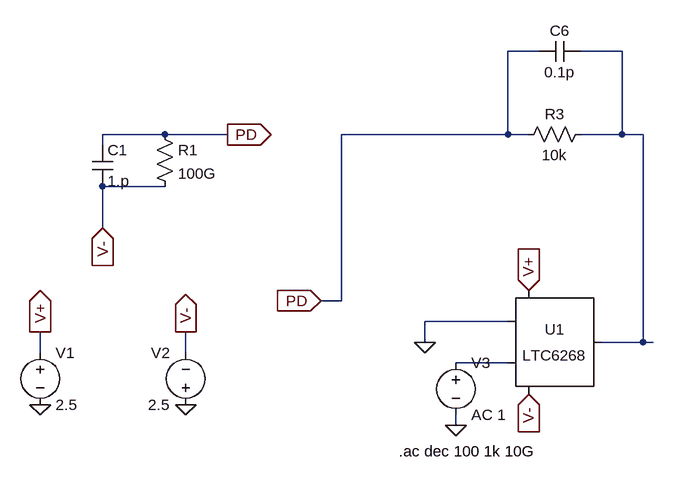
[diagram p0: schematic LTC6268.asc]
LTC6268.asc, the LTspice schematic file:
Version 4
SHEET 1 2104 680
WIRE 864 -224 816 -224
WIRE 992 -224 928 -224
WIRE 288 -96 192 -96
WIRE 384 -96 288 -96
WIRE 816 -96 816 -224
WIRE 816 -96 560 -96
WIRE 848 -96 816 -96
WIRE 992 -96 992 -224
WIRE 992 -96 928 -96
WIRE 1024 -96 992 -96
WIRE 192 -80 192 -96
WIRE 288 -16 192 -16
WIRE 192 48 192 -16
WIRE 560 160 560 -96
WIRE 560 160 528 160
WIRE 816 192 688 192
WIRE 688 224 688 192
WIRE 1024 224 1024 -96
WIRE 1024 224 960 224
WIRE 1040 224 1024 224
WIRE 96 240 96 208
WIRE 320 240 320 208
WIRE 816 256 736 256
WIRE 736 352 736 336
FLAG 96 320 0
FLAG 320 320 0
FLAG 192 48 V-
IOPIN 192 48 In
FLAG 384 -96 PD
IOPIN 384 -96 Out
FLAG 96 208 V+
IOPIN 96 208 Out
FLAG 320 208 V-
IOPIN 320 208 Out
FLAG 848 304 V-
IOPIN 848 304 In
FLAG 848 144 V+
IOPIN 848 144 In
FLAG 528 160 PD
IOPIN 528 160 In
FLAG 688 224 0
FLAG 736 352 0
SYMBOL cap 176 -80 R0
SYMATTR InstName C1
SYMATTR Value 1.p
SYMBOL res 272 -112 R0
SYMATTR InstName R1
SYMATTR Value 100G
SYMBOL voltage 96 224 R0
WINDOW 123 0 0 Left 2
WINDOW 39 0 0 Left 2
SYMATTR InstName V1
SYMATTR Value 2.5
SYMBOL voltage 320 336 R180
WINDOW 0 24 96 Left 2
WINDOW 3 24 16 Left 2
SYMATTR InstName V2
SYMATTR Value 2.5
SYMBOL res 944 -112 R90
WINDOW 0 0 56 VBottom 2
WINDOW 3 32 56 VTop 2
SYMATTR InstName R3
SYMATTR Value 10k
SYMBOL cap 928 -240 R90
WINDOW 0 0 32 VBottom 2
WINDOW 3 32 32 VTop 2
SYMATTR InstName C6
SYMATTR Value 0.1p
SYMBOL voltage 736 240 R0
SYMATTR InstName V3
SYMATTR Value AC 1
SYMBOL Opamps\\LTC6268 848 224 R0
SYMATTR InstName U1
TEXT 648 392 Left 2 !.ac dec 100 1k 10G

The netlist it stands for:
* LTC6268.asc
C1 PD V- 1.p
R1 PD V- 100G
V1 V+ 0 2.5
V2 0 V- 2.5
R3 N001 PD 10k
C6 N001 PD 0.1p
V3 N002 0 AC 1
XU1 N002 0 N001 V+ V- NC_01 LTC6268
.ac dec 100 1k 10G
.lib LTC2.lib
.backanno
.end